# EAGLE schematic LED-Matrix (EAGLE 9.6.2)
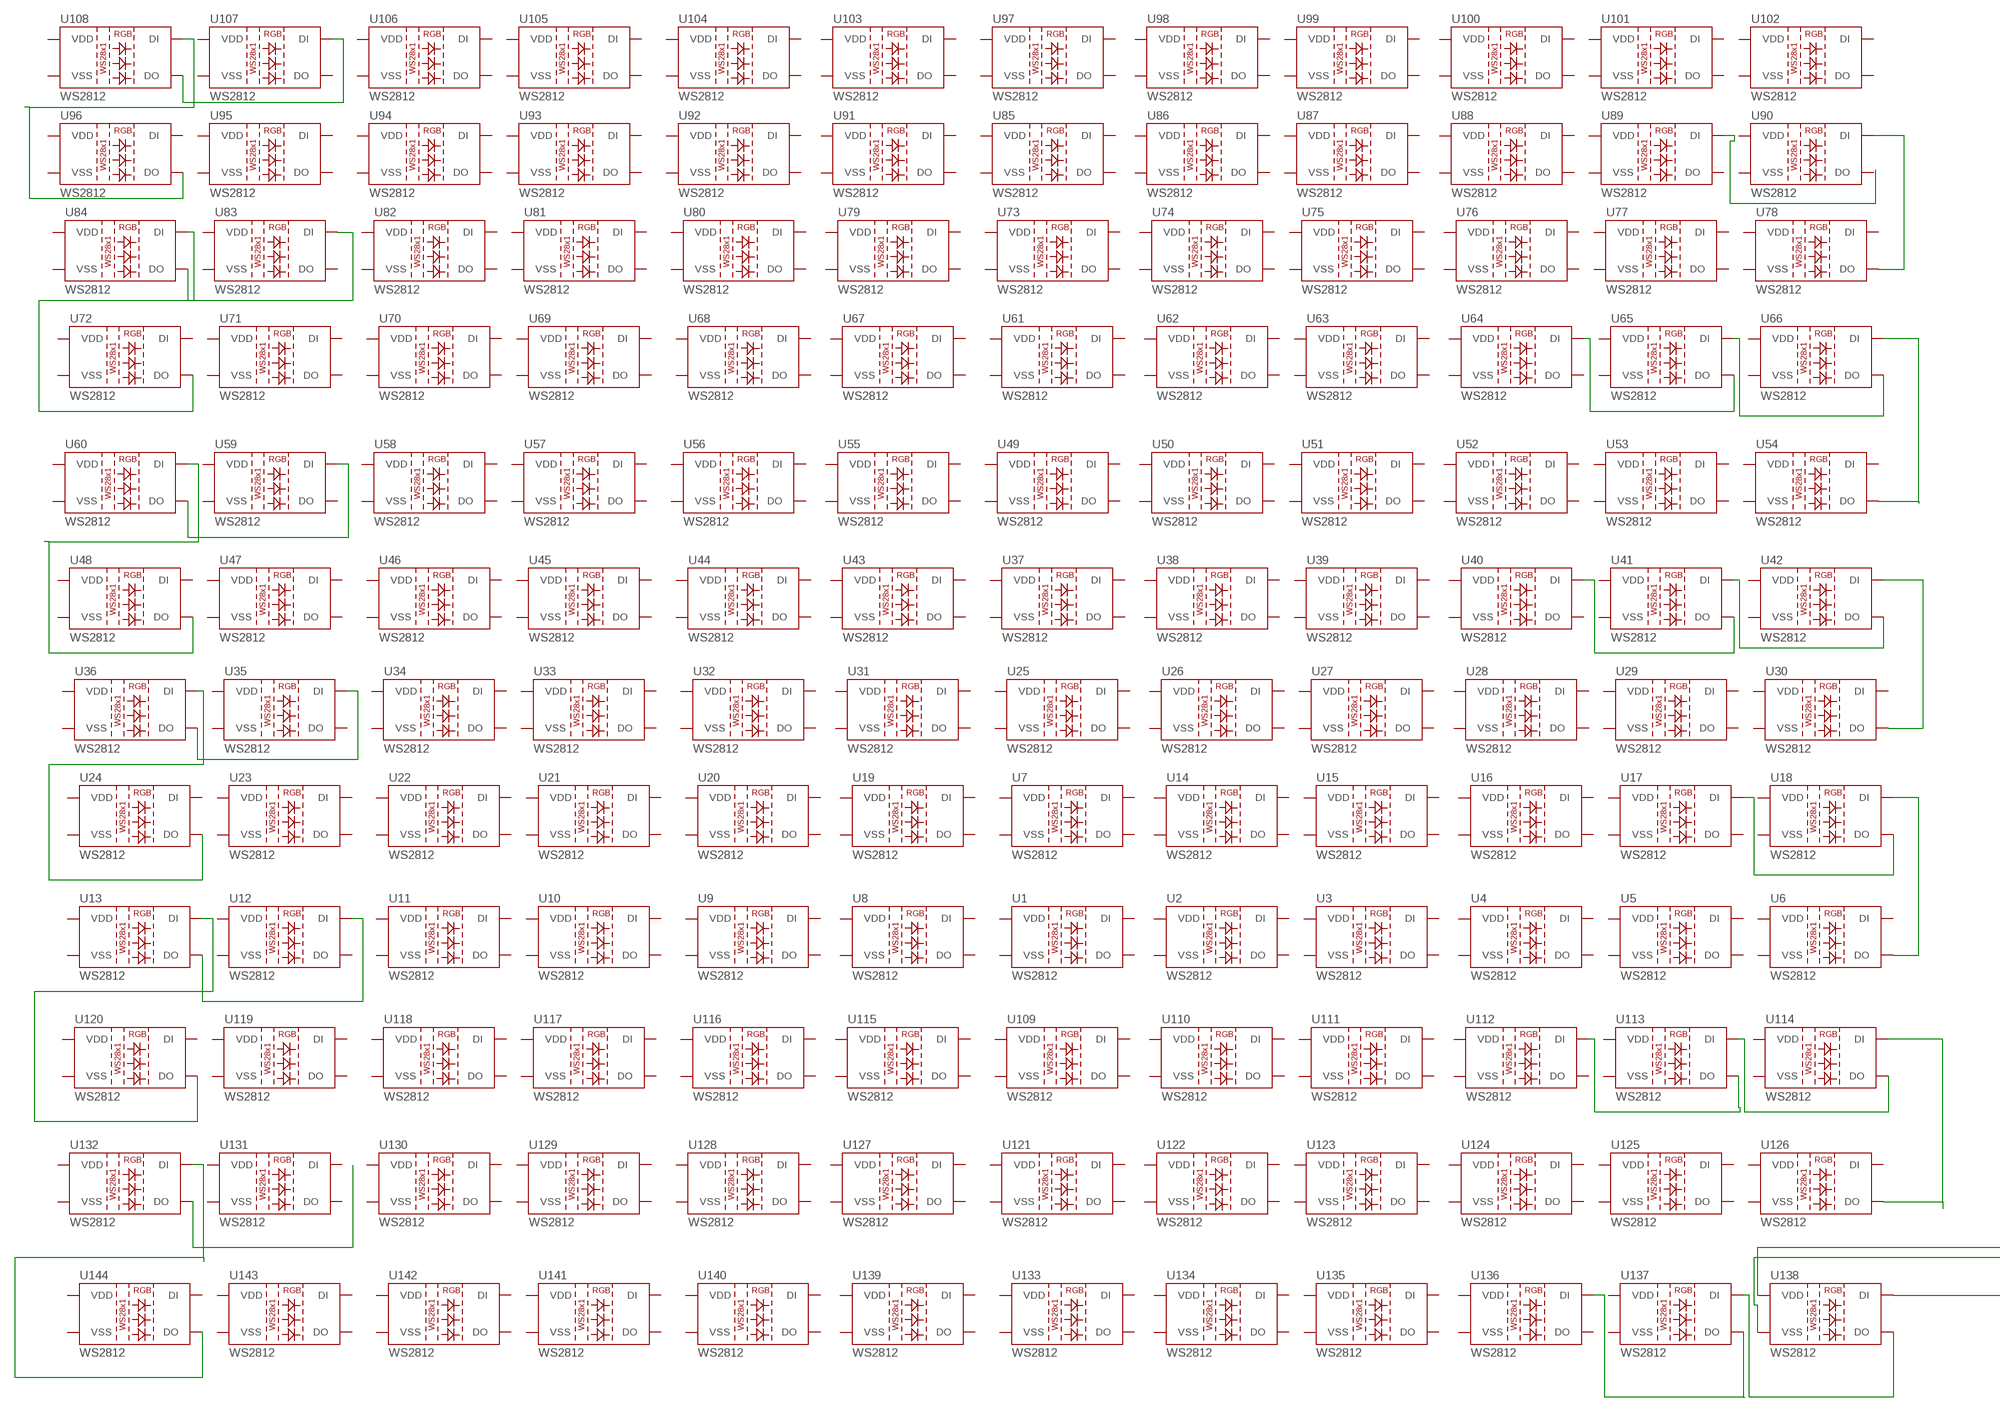
[diagram p0: schematic, sheet 1, part 1 of 2]
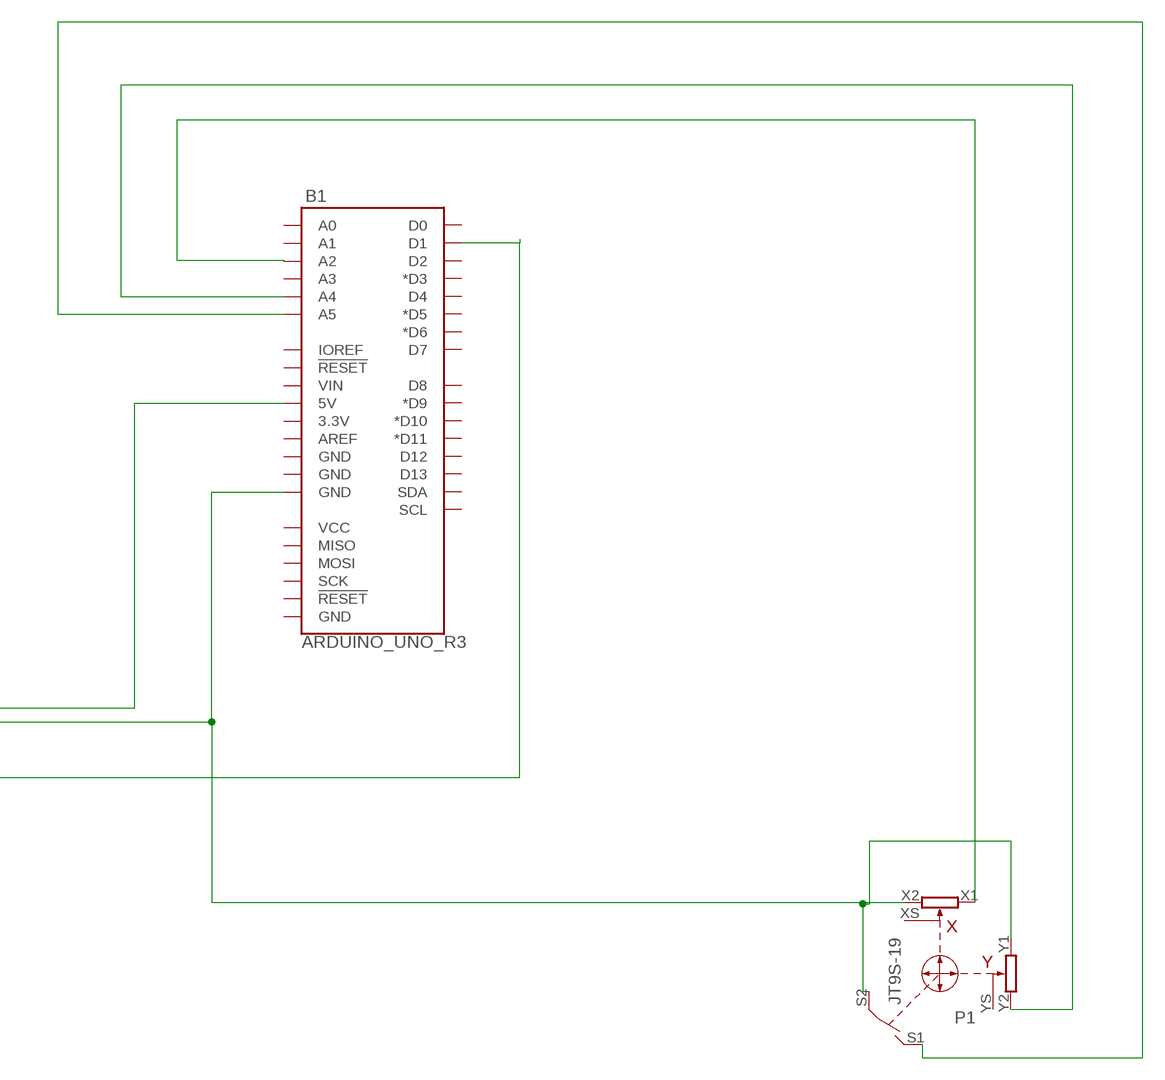
[diagram p1: schematic, sheet 1, part 2 of 2]

## Parts
B1  ARDUINO_UNO_R3  [ARDUINO_R3]
P1  JT9S-19  [JT9S-1P]
U1  WS2812  WS2812"  [LED-TRICOLOR-5050-IC]
U2  WS2812  WS2812"  [LED-TRICOLOR-5050-IC]
U3  WS2812  WS2812"  [LED-TRICOLOR-5050-IC]
U4  WS2812  WS2812"  [LED-TRICOLOR-5050-IC]
U5  WS2812  WS2812"  [LED-TRICOLOR-5050-IC]
U6  WS2812  WS2812"  [LED-TRICOLOR-5050-IC]
U7  WS2812  WS2812"  [LED-TRICOLOR-5050-IC]
U8  WS2812  WS2812"  [LED-TRICOLOR-5050-IC]
U9  WS2812  WS2812"  [LED-TRICOLOR-5050-IC]
U10  WS2812  WS2812"  [LED-TRICOLOR-5050-IC]
U11  WS2812  WS2812"  [LED-TRICOLOR-5050-IC]
U12  WS2812  WS2812"  [LED-TRICOLOR-5050-IC]
U13  WS2812  WS2812"  [LED-TRICOLOR-5050-IC]
U14  WS2812  WS2812"  [LED-TRICOLOR-5050-IC]
U15  WS2812  WS2812"  [LED-TRICOLOR-5050-IC]
U16  WS2812  WS2812"  [LED-TRICOLOR-5050-IC]
U17  WS2812  WS2812"  [LED-TRICOLOR-5050-IC]
U18  WS2812  WS2812"  [LED-TRICOLOR-5050-IC]
U19  WS2812  WS2812"  [LED-TRICOLOR-5050-IC]
U20  WS2812  WS2812"  [LED-TRICOLOR-5050-IC]
U21  WS2812  WS2812"  [LED-TRICOLOR-5050-IC]
U22  WS2812  WS2812"  [LED-TRICOLOR-5050-IC]
U23  WS2812  WS2812"  [LED-TRICOLOR-5050-IC]
U24  WS2812  WS2812"  [LED-TRICOLOR-5050-IC]
U25  WS2812  WS2812"  [LED-TRICOLOR-5050-IC]
U26  WS2812  WS2812"  [LED-TRICOLOR-5050-IC]
U27  WS2812  WS2812"  [LED-TRICOLOR-5050-IC]
U28  WS2812  WS2812"  [LED-TRICOLOR-5050-IC]
U29  WS2812  WS2812"  [LED-TRICOLOR-5050-IC]
U30  WS2812  WS2812"  [LED-TRICOLOR-5050-IC]
U31  WS2812  WS2812"  [LED-TRICOLOR-5050-IC]
U32  WS2812  WS2812"  [LED-TRICOLOR-5050-IC]
U33  WS2812  WS2812"  [LED-TRICOLOR-5050-IC]
U34  WS2812  WS2812"  [LED-TRICOLOR-5050-IC]
U35  WS2812  WS2812"  [LED-TRICOLOR-5050-IC]
U36  WS2812  WS2812"  [LED-TRICOLOR-5050-IC]
U37  WS2812  WS2812"  [LED-TRICOLOR-5050-IC]
U38  WS2812  WS2812"  [LED-TRICOLOR-5050-IC]
U39  WS2812  WS2812"  [LED-TRICOLOR-5050-IC]
U40  WS2812  WS2812"  [LED-TRICOLOR-5050-IC]
U41  WS2812  WS2812"  [LED-TRICOLOR-5050-IC]
U42  WS2812  WS2812"  [LED-TRICOLOR-5050-IC]
U43  WS2812  WS2812"  [LED-TRICOLOR-5050-IC]
U44  WS2812  WS2812"  [LED-TRICOLOR-5050-IC]
U45  WS2812  WS2812"  [LED-TRICOLOR-5050-IC]
U46  WS2812  WS2812"  [LED-TRICOLOR-5050-IC]
U47  WS2812  WS2812"  [LED-TRICOLOR-5050-IC]
U48  WS2812  WS2812"  [LED-TRICOLOR-5050-IC]
U49  WS2812  WS2812"  [LED-TRICOLOR-5050-IC]
U50  WS2812  WS2812"  [LED-TRICOLOR-5050-IC]
U51  WS2812  WS2812"  [LED-TRICOLOR-5050-IC]
U52  WS2812  WS2812"  [LED-TRICOLOR-5050-IC]
U53  WS2812  WS2812"  [LED-TRICOLOR-5050-IC]
U54  WS2812  WS2812"  [LED-TRICOLOR-5050-IC]
U55  WS2812  WS2812"  [LED-TRICOLOR-5050-IC]
U56  WS2812  WS2812"  [LED-TRICOLOR-5050-IC]
U57  WS2812  WS2812"  [LED-TRICOLOR-5050-IC]
U58  WS2812  WS2812"  [LED-TRICOLOR-5050-IC]
U59  WS2812  WS2812"  [LED-TRICOLOR-5050-IC]
U60  WS2812  WS2812"  [LED-TRICOLOR-5050-IC]
U61  WS2812  WS2812"  [LED-TRICOLOR-5050-IC]
U62  WS2812  WS2812"  [LED-TRICOLOR-5050-IC]
U63  WS2812  WS2812"  [LED-TRICOLOR-5050-IC]
U64  WS2812  WS2812"  [LED-TRICOLOR-5050-IC]
U65  WS2812  WS2812"  [LED-TRICOLOR-5050-IC]
U66  WS2812  WS2812"  [LED-TRICOLOR-5050-IC]
U67  WS2812  WS2812"  [LED-TRICOLOR-5050-IC]
U68  WS2812  WS2812"  [LED-TRICOLOR-5050-IC]
U69  WS2812  WS2812"  [LED-TRICOLOR-5050-IC]
U70  WS2812  WS2812"  [LED-TRICOLOR-5050-IC]
U71  WS2812  WS2812"  [LED-TRICOLOR-5050-IC]
U72  WS2812  WS2812"  [LED-TRICOLOR-5050-IC]
U73  WS2812  WS2812"  [LED-TRICOLOR-5050-IC]
U74  WS2812  WS2812"  [LED-TRICOLOR-5050-IC]
U75  WS2812  WS2812"  [LED-TRICOLOR-5050-IC]
U76  WS2812  WS2812"  [LED-TRICOLOR-5050-IC]
U77  WS2812  WS2812"  [LED-TRICOLOR-5050-IC]
U78  WS2812  WS2812"  [LED-TRICOLOR-5050-IC]
U79  WS2812  WS2812"  [LED-TRICOLOR-5050-IC]
U80  WS2812  WS2812"  [LED-TRICOLOR-5050-IC]
U81  WS2812  WS2812"  [LED-TRICOLOR-5050-IC]
U82  WS2812  WS2812"  [LED-TRICOLOR-5050-IC]
U83  WS2812  WS2812"  [LED-TRICOLOR-5050-IC]
U84  WS2812  WS2812"  [LED-TRICOLOR-5050-IC]
U85  WS2812  WS2812"  [LED-TRICOLOR-5050-IC]
U86  WS2812  WS2812"  [LED-TRICOLOR-5050-IC]
U87  WS2812  WS2812"  [LED-TRICOLOR-5050-IC]
U88  WS2812  WS2812"  [LED-TRICOLOR-5050-IC]
U89  WS2812  WS2812"  [LED-TRICOLOR-5050-IC]
U90  WS2812  WS2812"  [LED-TRICOLOR-5050-IC]
U91  WS2812  WS2812"  [LED-TRICOLOR-5050-IC]
U92  WS2812  WS2812"  [LED-TRICOLOR-5050-IC]
U93  WS2812  WS2812"  [LED-TRICOLOR-5050-IC]
U94  WS2812  WS2812"  [LED-TRICOLOR-5050-IC]
U95  WS2812  WS2812"  [LED-TRICOLOR-5050-IC]
U96  WS2812  WS2812"  [LED-TRICOLOR-5050-IC]
U97  WS2812  WS2812"  [LED-TRICOLOR-5050-IC]
U98  WS2812  WS2812"  [LED-TRICOLOR-5050-IC]
U99  WS2812  WS2812"  [LED-TRICOLOR-5050-IC]
U100  WS2812  WS2812"  [LED-TRICOLOR-5050-IC]
U101  WS2812  WS2812"  [LED-TRICOLOR-5050-IC]
U102  WS2812  WS2812"  [LED-TRICOLOR-5050-IC]
U103  WS2812  WS2812"  [LED-TRICOLOR-5050-IC]
U104  WS2812  WS2812"  [LED-TRICOLOR-5050-IC]
U105  WS2812  WS2812"  [LED-TRICOLOR-5050-IC]
U106  WS2812  WS2812"  [LED-TRICOLOR-5050-IC]
U107  WS2812  WS2812"  [LED-TRICOLOR-5050-IC]
U108  WS2812  WS2812"  [LED-TRICOLOR-5050-IC]
U109  WS2812  WS2812"  [LED-TRICOLOR-5050-IC]
U110  WS2812  WS2812"  [LED-TRICOLOR-5050-IC]
U111  WS2812  WS2812"  [LED-TRICOLOR-5050-IC]
U112  WS2812  WS2812"  [LED-TRICOLOR-5050-IC]
U113  WS2812  WS2812"  [LED-TRICOLOR-5050-IC]
U114  WS2812  WS2812"  [LED-TRICOLOR-5050-IC]
U115  WS2812  WS2812"  [LED-TRICOLOR-5050-IC]
U116  WS2812  WS2812"  [LED-TRICOLOR-5050-IC]
U117  WS2812  WS2812"  [LED-TRICOLOR-5050-IC]
U118  WS2812  WS2812"  [LED-TRICOLOR-5050-IC]
U119  WS2812  WS2812"  [LED-TRICOLOR-5050-IC]
U120  WS2812  WS2812"  [LED-TRICOLOR-5050-IC]
U121  WS2812  WS2812"  [LED-TRICOLOR-5050-IC]
U122  WS2812  WS2812"  [LED-TRICOLOR-5050-IC]
U123  WS2812  WS2812"  [LED-TRICOLOR-5050-IC]
U124  WS2812  WS2812"  [LED-TRICOLOR-5050-IC]
U125  WS2812  WS2812"  [LED-TRICOLOR-5050-IC]
U126  WS2812  WS2812"  [LED-TRICOLOR-5050-IC]
U127  WS2812  WS2812"  [LED-TRICOLOR-5050-IC]
U128  WS2812  WS2812"  [LED-TRICOLOR-5050-IC]
U129  WS2812  WS2812"  [LED-TRICOLOR-5050-IC]
U130  WS2812  WS2812"  [LED-TRICOLOR-5050-IC]
U131  WS2812  WS2812"  [LED-TRICOLOR-5050-IC]
U132  WS2812  WS2812"  [LED-TRICOLOR-5050-IC]
U133  WS2812  WS2812"  [LED-TRICOLOR-5050-IC]
U134  WS2812  WS2812"  [LED-TRICOLOR-5050-IC]
U135  WS2812  WS2812"  [LED-TRICOLOR-5050-IC]
U136  WS2812  WS2812"  [LED-TRICOLOR-5050-IC]
U137  WS2812  WS2812"  [LED-TRICOLOR-5050-IC]
U138  WS2812  WS2812"  [LED-TRICOLOR-5050-IC]
U139  WS2812  WS2812"  [LED-TRICOLOR-5050-IC]
U140  WS2812  WS2812"  [LED-TRICOLOR-5050-IC]
U141  WS2812  WS2812"  [LED-TRICOLOR-5050-IC]
U142  WS2812  WS2812"  [LED-TRICOLOR-5050-IC]
U143  WS2812  WS2812"  [LED-TRICOLOR-5050-IC]
U144  WS2812  WS2812"  [LED-TRICOLOR-5050-IC]

## Nets
N$1: U137.2(DI) U138.1(DO)
N$2: U136.2(DI) U137.1(DO)
N$3: B1.D1 U138.2(DI)
N$4: B1.5V U138.3(VDD) U138.5(VDD)
N$5: B1.GND@2(GND) P1.X2 U138.6(VSS)
N$6: U132.2(DI) U144.1(DO)
N$7: U132.1(DO)
N$8: U114.2(DI) U126.1(DO)
N$9: U113.2(DI) U114.1(DO)
N$10: U112.2(DI) U113.1(DO)
N$11: U13.2(DI) U120.1(DO)
N$12: U12.2(DI) U13.1(DO)
N$13: U6.1(DO) U18.2(DI)
N$14: U17.2(DI) U18.1(DO)
N$15: U24.1(DO) U36.2(DI)
N$16: U35.2(DI) U36.1(DO)
N$17: U30.1(DO) U42.2(DI)
N$18: U41.2(DI) U42.1(DO)
N$19: U40.2(DI) U41.1(DO)
N$20: U48.1(DO) U60.2(DI)
N$21: U59.2(DI) U60.1(DO)
N$22: U54.1(DO) U66.2(DI)
N$23: U65.2(DI) U66.1(DO)
N$24: U64.2(DI) U65.1(DO)
N$25: U72.1(DO) U84.2(DI)
N$26: U83.2(DI) U84.1(DO)
N$27: U78.1(DO) U90.2(DI)
N$28: U89.2(DI)
N$29: U96.1(DO) U108.2(DI)
N$30: U107.2(DI) U108.1(DO)
N$31: B1.A2 P1.X1
N$32: B1.A4 P1.Y2
N$33: B1.A5 P1.S1
N$34: P1.S2 P1.Y1
Unconnected: B1.3.3V B1.A0 B1.A1 B1.A3 B1.AREF B1.D0 B1.D2 B1.D3(*D3) B1.D4 B1.D5(*D5) B1.D6(*D6) B1.D7 B1.D8 B1.D9(*D9) B1.D10(*D10) B1.D11(*D11) B1.D12 B1.D13 B1.GND@1(GND) B1.GND@3(GND) B1.GND@4(GND) B1.IOREF B1.MISO B1.MOSI B1.RESET@1(!RESET!) B1.RESET@2(!RESET!) B1.SCK B1.SCL B1.SDA B1.VCC B1.VIN P1.XS P1.YS U1.1(DO) U1.2(DI) U1.3(VDD) U1.5(VDD) U1.6(VSS) U2.1(DO) U2.2(DI) U2.3(VDD) U2.5(VDD) U2.6(VSS) U3.1(DO) U3.2(DI) U3.3(VDD) U3.5(VDD) U3.6(VSS) U4.1(DO) U4.2(DI) U4.3(VDD) U4.5(VDD) U4.6(VSS) U5.1(DO) U5.2(DI) U5.3(VDD) U5.5(VDD) U5.6(VSS) U6.2(DI) U6.3(VDD) U6.5(VDD) U6.6(VSS) U7.1(DO) U7.2(DI) U7.3(VDD) U7.5(VDD) U7.6(VSS) U8.1(DO) U8.2(DI) U8.3(VDD) U8.5(VDD) U8.6(VSS) U9.1(DO) U9.2(DI) U9.3(VDD) U9.5(VDD) U9.6(VSS) U10.1(DO) U10.2(DI) U10.3(VDD) U10.5(VDD) U10.6(VSS) U11.1(DO) U11.2(DI) U11.3(VDD) U11.5(VDD) U11.6(VSS) U12.1(DO) U12.3(VDD) U12.5(VDD) U12.6(VSS) U13.3(VDD) U13.5(VDD) U13.6(VSS) U14.1(DO) U14.2(DI) U14.3(VDD) U14.5(VDD) U14.6(VSS) U15.1(DO) U15.2(DI) U15.3(VDD) U15.5(VDD) U15.6(VSS) U16.1(DO) U16.2(DI) U16.3(VDD) U16.5(VDD) U16.6(VSS) U17.1(DO) U17.3(VDD) U17.5(VDD) U17.6(VSS) U18.3(VDD) U18.5(VDD) U18.6(VSS) U19.1(DO) U19.2(DI) U19.3(VDD) U19.5(VDD) U19.6(VSS) U20.1(DO) U20.2(DI) U20.3(VDD) U20.5(VDD) U20.6(VSS) U21.1(DO) U21.2(DI) U21.3(VDD) U21.5(VDD) U21.6(VSS) U22.1(DO) U22.2(DI) U22.3(VDD) U22.5(VDD) U22.6(VSS) U23.1(DO) U23.2(DI) U23.3(VDD) U23.5(VDD) U23.6(VSS) U24.2(DI) U24.3(VDD) U24.5(VDD) U24.6(VSS) U25.1(DO) U25.2(DI) U25.3(VDD) U25.5(VDD) U25.6(VSS) U26.1(DO) U26.2(DI) U26.3(VDD) U26.5(VDD) U26.6(VSS) U27.1(DO) U27.2(DI) U27.3(VDD) U27.5(VDD) U27.6(VSS) U28.1(DO) U28.2(DI) U28.3(VDD) U28.5(VDD) U28.6(VSS) U29.1(DO) U29.2(DI) U29.3(VDD) U29.5(VDD) U29.6(VSS) U30.2(DI) U30.3(VDD) U30.5(VDD) U30.6(VSS) U31.1(DO) U31.2(DI) U31.3(VDD) U31.5(VDD) U31.6(VSS) U32.1(DO) U32.2(DI) U32.3(VDD) U32.5(VDD) U32.6(VSS) U33.1(DO) U33.2(DI) U33.3(VDD) U33.5(VDD) U33.6(VSS) U34.1(DO) U34.2(DI) U34.3(VDD) U34.5(VDD) U34.6(VSS) U35.1(DO) U35.3(VDD) U35.5(VDD) U35.6(VSS) U36.3(VDD) U36.5(VDD) U36.6(VSS) U37.1(DO) U37.2(DI) U37.3(VDD) U37.5(VDD) U37.6(VSS) U38.1(DO) U38.2(DI) U38.3(VDD) U38.5(VDD) U38.6(VSS) U39.1(DO) U39.2(DI) U39.3(VDD) U39.5(VDD) U39.6(VSS) U40.1(DO) U40.3(VDD) U40.5(VDD) U40.6(VSS) U41.3(VDD) U41.5(VDD) U41.6(VSS) U42.3(VDD) U42.5(VDD) U42.6(VSS) U43.1(DO) U43.2(DI) U43.3(VDD) U43.5(VDD) U43.6(VSS) U44.1(DO) U44.2(DI) U44.3(VDD) U44.5(VDD) U44.6(VSS) U45.1(DO) U45.2(DI) U45.3(VDD) U45.5(VDD) U45.6(VSS) U46.1(DO) U46.2(DI) U46.3(VDD) U46.5(VDD) U46.6(VSS) U47.1(DO) U47.2(DI) U47.3(VDD) U47.5(VDD) U47.6(VSS) U48.2(DI) U48.3(VDD) U48.5(VDD) U48.6(VSS) U49.1(DO) U49.2(DI) U49.3(VDD) U49.5(VDD) U49.6(VSS) U50.1(DO) U50.2(DI) U50.3(VDD) U50.5(VDD) U50.6(VSS) U51.1(DO) U51.2(DI) U51.3(VDD) U51.5(VDD) U51.6(VSS) U52.1(DO) U52.2(DI) U52.3(VDD) U52.5(VDD) U52.6(VSS) U53.1(DO) U53.2(DI) U53.3(VDD) U53.5(VDD) U53.6(VSS) U54.2(DI) U54.3(VDD) U54.5(VDD) U54.6(VSS) U55.1(DO) U55.2(DI) U55.3(VDD) U55.5(VDD) U55.6(VSS) U56.1(DO) U56.2(DI) U56.3(VDD) U56.5(VDD) U56.6(VSS) U57.1(DO) U57.2(DI) U57.3(VDD) U57.5(VDD) U57.6(VSS) U58.1(DO) U58.2(DI) U58.3(VDD) U58.5(VDD) U58.6(VSS) U59.1(DO) U59.3(VDD) U59.5(VDD) U59.6(VSS) U60.3(VDD) U60.5(VDD) U60.6(VSS) U61.1(DO) U61.2(DI) U61.3(VDD) U61.5(VDD) U61.6(VSS) U62.1(DO) U62.2(DI) U62.3(VDD) U62.5(VDD) U62.6(VSS) U63.1(DO) U63.2(DI) U63.3(VDD) U63.5(VDD) U63.6(VSS) U64.1(DO) U64.3(VDD) U64.5(VDD) U64.6(VSS) U65.3(VDD) U65.5(VDD) U65.6(VSS) U66.3(VDD) U66.5(VDD) U66.6(VSS) U67.1(DO) U67.2(DI) U67.3(VDD) U67.5(VDD) U67.6(VSS) U68.1(DO) U68.2(DI) U68.3(VDD) U68.5(VDD) U68.6(VSS) U69.1(DO) U69.2(DI) U69.3(VDD) U69.5(VDD) U69.6(VSS) U70.1(DO) U70.2(DI) U70.3(VDD) U70.5(VDD) U70.6(VSS) U71.1(DO) U71.2(DI) U71.3(VDD) U71.5(VDD) U71.6(VSS) U72.2(DI) U72.3(VDD) U72.5(VDD) U72.6(VSS) U73.1(DO) U73.2(DI) U73.3(VDD) U73.5(VDD) U73.6(VSS) U74.1(DO) U74.2(DI) U74.3(VDD) U74.5(VDD) U74.6(VSS) U75.1(DO) U75.2(DI) U75.3(VDD) U75.5(VDD) U75.6(VSS) U76.1(DO) U76.2(DI) U76.3(VDD) U76.5(VDD) U76.6(VSS) U77.1(DO) U77.2(DI) U77.3(VDD) U77.5(VDD) U77.6(VSS) U78.2(DI) U78.3(VDD) U78.5(VDD) U78.6(VSS) U79.1(DO) U79.2(DI) U79.3(VDD) U79.5(VDD) U79.6(VSS) U80.1(DO) U80.2(DI) U80.3(VDD) U80.5(VDD) U80.6(VSS) U81.1(DO) U81.2(DI) U81.3(VDD) U81.5(VDD) U81.6(VSS) U82.1(DO) U82.2(DI) U82.3(VDD) U82.5(VDD) U82.6(VSS) U83.1(DO) U83.3(VDD) U83.5(VDD) U83.6(VSS) U84.3(VDD) U84.5(VDD) U84.6(VSS) U85.1(DO) U85.2(DI) U85.3(VDD) U85.5(VDD) U85.6(VSS) U86.1(DO) U86.2(DI) U86.3(VDD) U86.5(VDD) U86.6(VSS) U87.1(DO) U87.2(DI) U87.3(VDD) U87.5(VDD) U87.6(VSS) U88.1(DO) U88.2(DI) U88.3(VDD) U88.5(VDD) U88.6(VSS) U89.1(DO) U89.3(VDD) U89.5(VDD) U89.6(VSS) U90.1(DO) U90.3(VDD) U90.5(VDD) U90.6(VSS) U91.1(DO) U91.2(DI) U91.3(VDD) U91.5(VDD) U91.6(VSS) U92.1(DO) U92.2(DI) U92.3(VDD) U92.5(VDD) U92.6(VSS) U93.1(DO) U93.2(DI) U93.3(VDD) U93.5(VDD) U93.6(VSS) U94.1(DO) U94.2(DI) U94.3(VDD) U94.5(VDD) U94.6(VSS) U95.1(DO) U95.2(DI) U95.3(VDD) U95.5(VDD) U95.6(VSS) U96.2(DI) U96.3(VDD) U96.5(VDD) U96.6(VSS) U97.1(DO) U97.2(DI) U97.3(VDD) U97.5(VDD) U97.6(VSS) U98.1(DO) U98.2(DI) U98.3(VDD) U98.5(VDD) U98.6(VSS) U99.1(DO) U99.2(DI) U99.3(VDD) U99.5(VDD) U99.6(VSS) U100.1(DO) U100.2(DI) U100.3(VDD) U100.5(VDD) U100.6(VSS) U101.1(DO) U101.2(DI) U101.3(VDD) U101.5(VDD) U101.6(VSS) U102.1(DO) U102.2(DI) U102.3(VDD) U102.5(VDD) U102.6(VSS) U103.1(DO) U103.2(DI) U103.3(VDD) U103.5(VDD) U103.6(VSS) U104.1(DO) U104.2(DI) U104.3(VDD) U104.5(VDD) U104.6(VSS) U105.1(DO) U105.2(DI) U105.3(VDD) U105.5(VDD) U105.6(VSS) U106.1(DO) U106.2(DI) U106.3(VDD) U106.5(VDD) U106.6(VSS) U107.1(DO) U107.3(VDD) U107.5(VDD) U107.6(VSS) U108.3(VDD) U108.5(VDD) U108.6(VSS) U109.1(DO) U109.2(DI) U109.3(VDD) U109.5(VDD) U109.6(VSS) U110.1(DO) U110.2(DI) U110.3(VDD) U110.5(VDD) U110.6(VSS) U111.1(DO) U111.2(DI) U111.3(VDD) U111.5(VDD) U111.6(VSS) U112.1(DO) U112.3(VDD) U112.5(VDD) U112.6(VSS) U113.3(VDD) U113.5(VDD) U113.6(VSS) U114.3(VDD) U114.5(VDD) U114.6(VSS) U115.1(DO) U115.2(DI) U115.3(VDD) U115.5(VDD) U115.6(VSS) U116.1(DO) U116.2(DI) U116.3(VDD) U116.5(VDD) U116.6(VSS) U117.1(DO) U117.2(DI) U117.3(VDD) U117.5(VDD) U117.6(VSS) U118.1(DO) U118.2(DI) U118.3(VDD) U118.5(VDD) U118.6(VSS) U119.1(DO) U119.2(DI) U119.3(VDD) U119.5(VDD) U119.6(VSS) U120.2(DI) U120.3(VDD) U120.5(VDD) U120.6(VSS) U121.1(DO) U121.2(DI) U121.3(VDD) U121.5(VDD) U121.6(VSS) U122.1(DO) U122.2(DI) U122.3(VDD) U122.5(VDD) U122.6(VSS) U123.1(DO) U123.2(DI) U123.3(VDD) U123.5(VDD) U123.6(VSS) U124.1(DO) U124.2(DI) U124.3(VDD) U124.5(VDD) U124.6(VSS) U125.1(DO) U125.2(DI) U125.3(VDD) U125.5(VDD) U125.6(VSS) U126.2(DI) U126.3(VDD) U126.5(VDD) U126.6(VSS) U127.1(DO) U127.2(DI) U127.3(VDD) U127.5(VDD) U127.6(VSS) U128.1(DO) U128.2(DI) U128.3(VDD) U128.5(VDD) U128.6(VSS) U129.1(DO) U129.2(DI) U129.3(VDD) U129.5(VDD) U129.6(VSS) U130.1(DO) U130.2(DI) U130.3(VDD) U130.5(VDD) U130.6(VSS) U131.1(DO) U131.2(DI) U131.3(VDD) U131.5(VDD) U131.6(VSS) U132.3(VDD) U132.5(VDD) U132.6(VSS) U133.1(DO) U133.2(DI) U133.3(VDD) U133.5(VDD) U133.6(VSS) U134.1(DO) U134.2(DI) U134.3(VDD) U134.5(VDD) U134.6(VSS) U135.1(DO) U135.2(DI) U135.3(VDD) U135.5(VDD) U135.6(VSS) U136.1(DO) U136.3(VDD) U136.5(VDD) U136.6(VSS) U137.3(VDD) U137.5(VDD) U137.6(VSS) U139.1(DO) U139.2(DI) U139.3(VDD) U139.5(VDD) U139.6(VSS) U140.1(DO) U140.2(DI) U140.3(VDD) U140.5(VDD) U140.6(VSS) U141.1(DO) U141.2(DI) U141.3(VDD) U141.5(VDD) U141.6(VSS) U142.1(DO) U142.2(DI) U142.3(VDD) U142.5(VDD) U142.6(VSS) U143.1(DO) U143.2(DI) U143.3(VDD) U143.5(VDD) U143.6(VSS) U144.2(DI) U144.3(VDD) U144.5(VDD) U144.6(VSS)

## Library data of the parts
B1 = SparkFun-Boards:ARDUINO_UNO_R3: Arduino R3 Footprint with SPI header Arduino Uno R3 Compatible Footprint. Matches PCB size of the original board. SparkFun Products: SAMD21 Dev Breakout <https://www.sparkfun.com/products/13672> RedBoard <https://www.sparkfun.com/products/12757> R3 Stackable Headers <https://www.sparkfun.com/products/11417>
P1 = jt9s-1p:JT9S-19: Joystick Potentiometer 10k
U1-U144 = SparkFun-LED:WS2812: WS2812 RGB LED w/ WS2811 driver 5x5mm SMD LED with built-in controller IC. Color: Red/Green/Blue mC Rating: RGB: 550, 1100, 200 mcd Current:RGB: 20, 20, 20 mA Forward Voltage: RGB: 1.8, 3.0, 3.2 V Packages:LED-TRICOLOR-5050-IC SparkFun Products: LED-SMD RGB (WS2812) <https://www.sparkfun.com/products/11821>; PROD_ID: DIO-11598